# Altium schematic sheet Sheet_2_Power.SchDoc: FBT AVR
size 594 x 420 mm; PageSetup: Record=PageOptions|CenterHorizontal=True|CenterVertical=True|PrintScale=1.00|XCorrection=1.00|YCorrection=1.00|PrintKind=1|BorderSize=5000000|LeftOffset=0|BottomOffset=0|Orientation=2|PaperLength=1000|PaperWidth=1000|Scale=100|PaperSource=15|PrintQuality=1200|MediaType=1|DitherType=10|PaperKind=A3|PrintScaleMode=1; Weight: -; ScaleFactor: -; NormInspection: Норм.Контр.; ApprovedBy: Neboron; CheckedBy: Neboron; DrawnBy: Neboron; DocumentNumber: LH.02.05.12.24 ЭЗ; SheetNumber: 1; SheetTotal: 4; Format: A2; Title1str: V1; ImagePath: 1
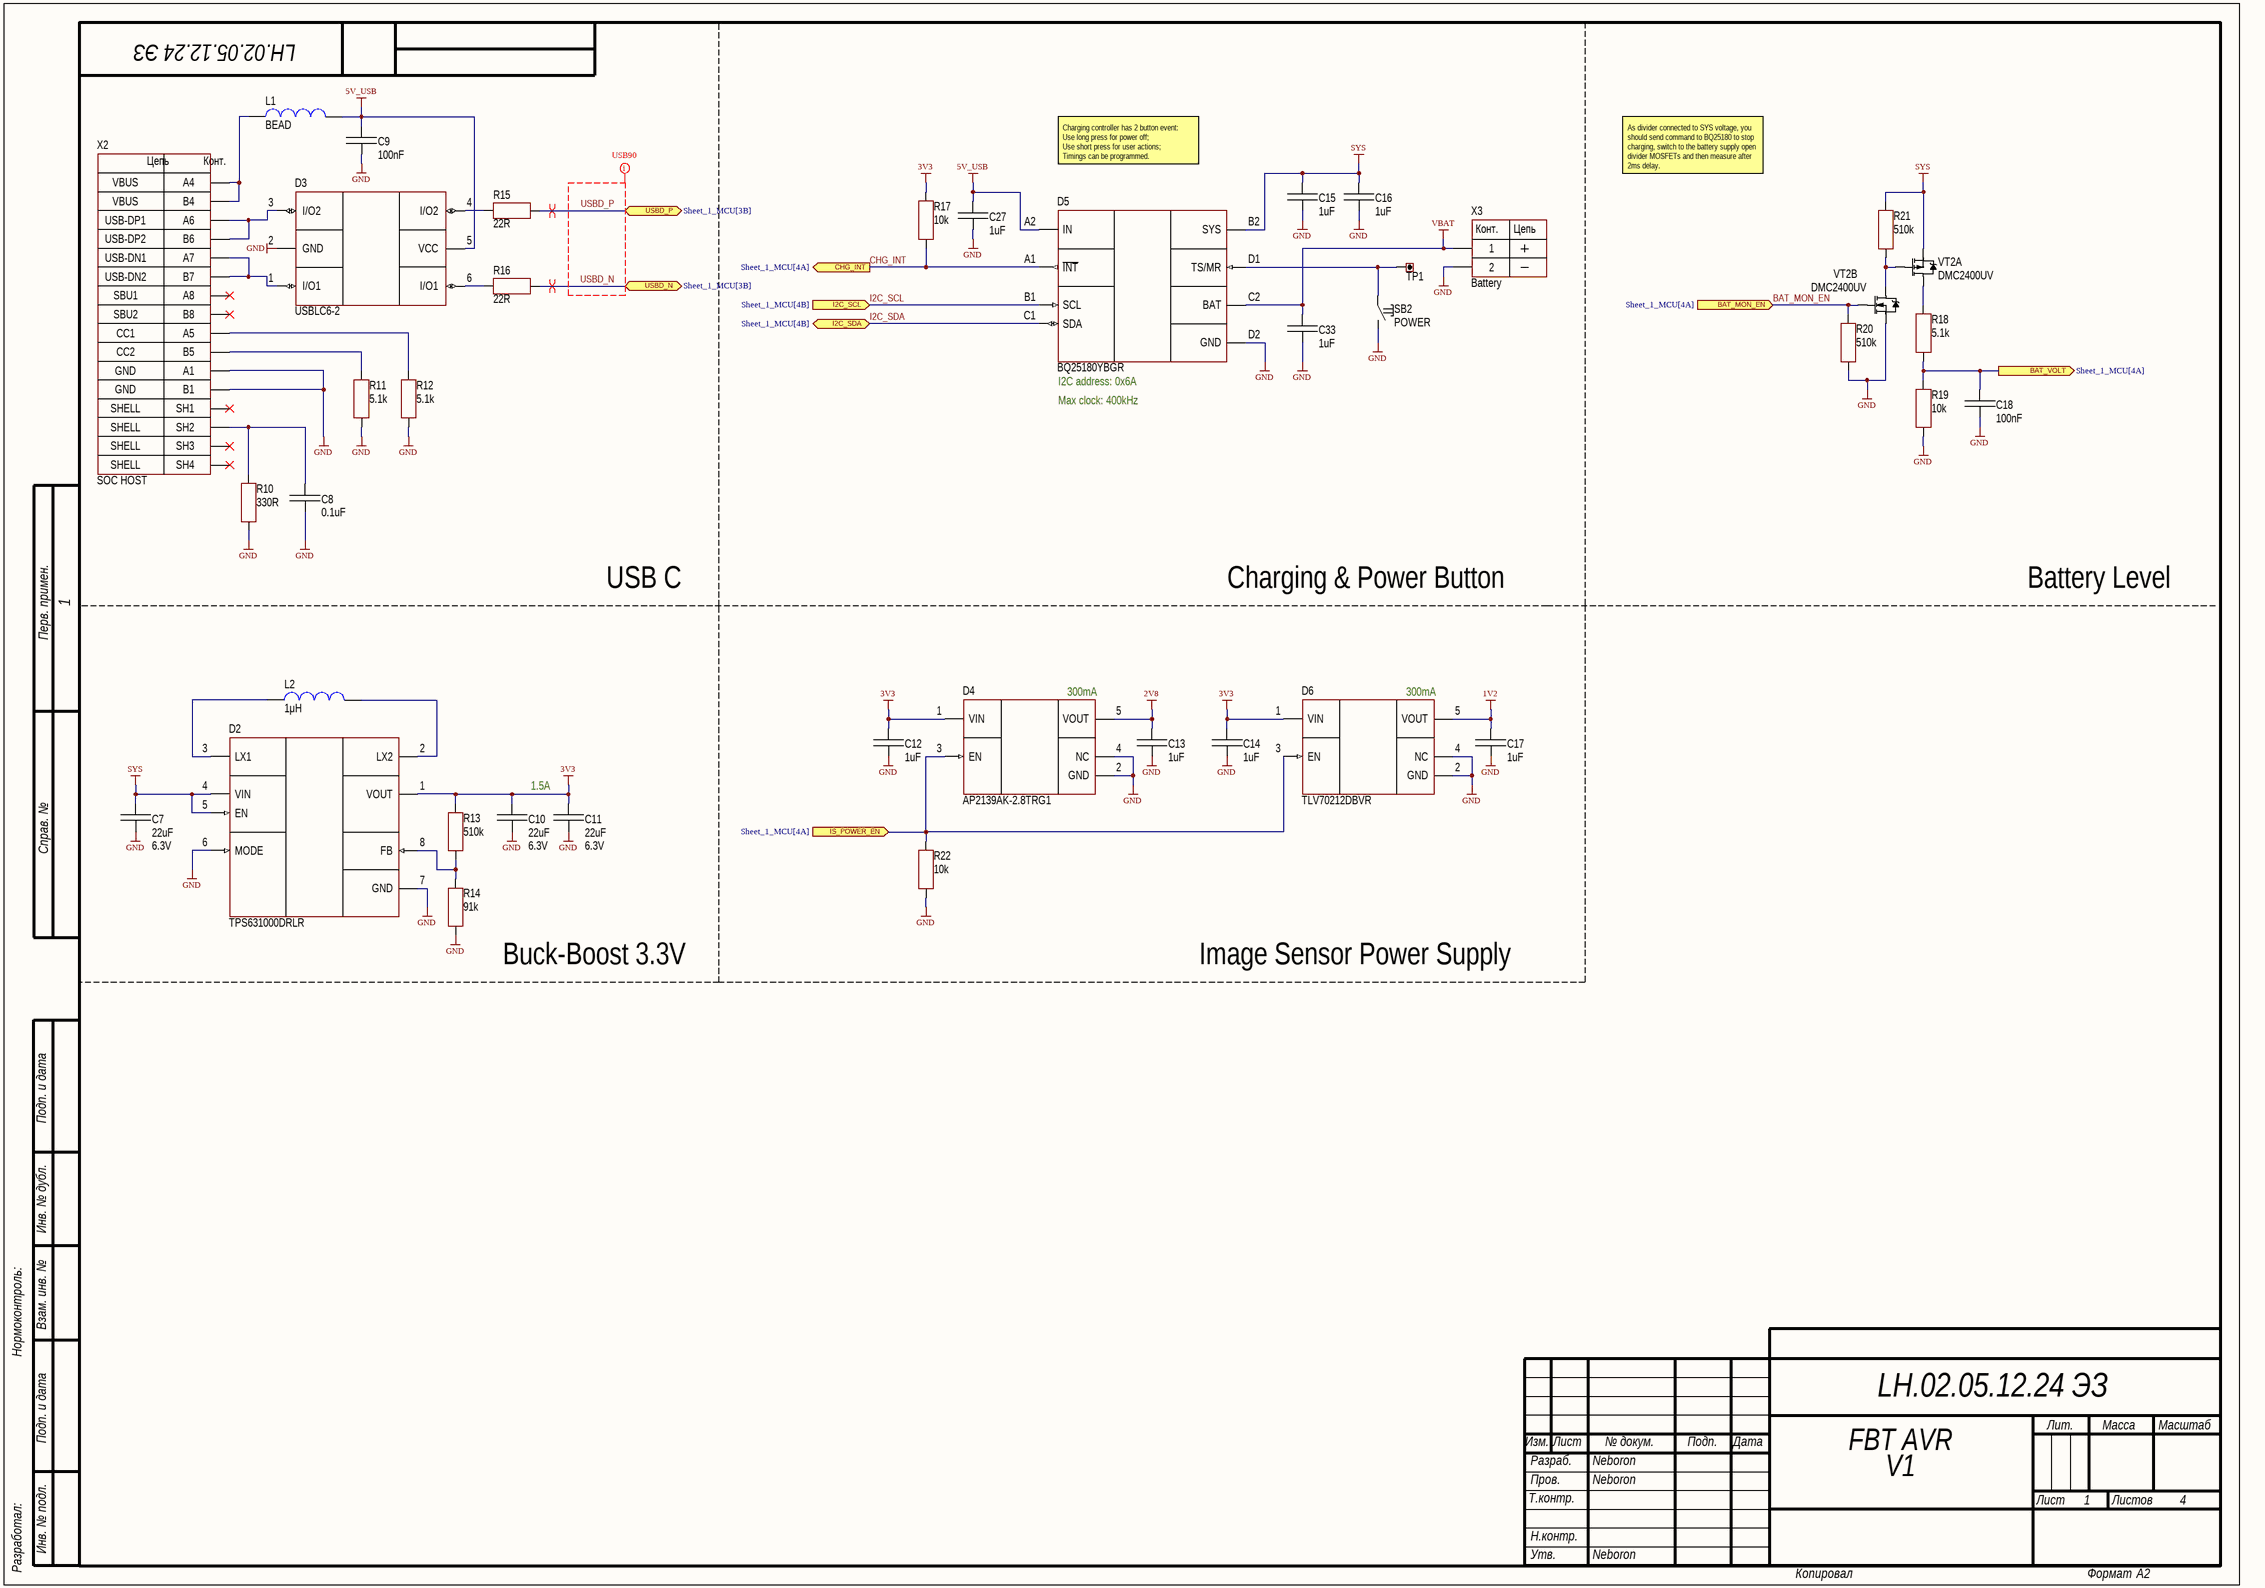
[diagram p0: Sheet_2_Power.SchDoc]

## Parts
C7  value 22uF  Voltage: 6.3V  [CAP: 0603]
C8  value 0.1uF  [CAP: 0603]
C9  value 100nF  [CAP: 0402]
C10  value 22uF  Voltage: 6.3V  [CAP: 0603]
C11  value 22uF  Voltage: 6.3V  [CAP: 0603]
C12  value 1uF  [CAP: 0402]
C13  value 1uF  [CAP: 0402]
C14  value 1uF  [CAP: 0402]
C15  value 1uF  [CAP: 0402]
C16  value 1uF  [CAP: 0402]
C17  value 1uF  [CAP: 0402]
C18  value 100nF  [CAP: 0402]
C27  value 1uF  [CAP: 0402]
C33  value 1uF  [CAP: 0402]
D2  (no value)  [SOT583-8]
D3  (no value)  [SOT23-6]
D4  (no value)  [SOT23-5]
D5  (no value)  [8-DSBGA]
D6  (no value)  [SOT23-5]
L1  value BEAD  [IND: 0402]
L2  value 1μH  [IND: 0805]
R10  value 330R  [RES: 0603]
R11  value 5.1k  [RES: 0402]
R12  value 5.1k  [RES: 0402]
R13  value 510k  [RES: 0402]
R14  value 91k  [RES: 0402]
R15  value 22R  [RES: 0402]
R16  value 22R  [RES: 0402]
R17  value 10k  [RES: 0402]
R18  value 5.1k  [RES: 0402]
R19  value 10k  [RES: 0402]
R20  value 510k  [RES: 0402]
R21  value 510k  [RES: 0402]
R22  value 10k  [RES: 0402]
SB2  CommentText: POWER  [BUT: TS-1186F-B-A]
TP1  (no value)  [CON: TEST POINT 1 MM]
VT2  PartNumber: DMC2400UV  [SOT563-6]  (parts A,B of 2)
X2  CommentText: SOC HOST  [CON: TYPE-C-SOFNG MC-311S]
X3  CommentText: Battery  [CON: BAT (2.00)]

## Ports
BAT_MON_EN (in, see Sheet_1_MCU[4A]), BAT_VOLT (out, see Sheet_1_MCU[4A]), CHG_INT (out, see Sheet_1_MCU[4A]), I2C_SCL (in, see Sheet_1_MCU[4B]), I2C_SDA (bidir, see Sheet_1_MCU[4B]), IS_POWER_EN (in, see Sheet_1_MCU[4A]), USBD_N (bidir, see Sheet_1_MCU[3B]), USBD_P (bidir, see Sheet_1_MCU[3B])

## Nets
1V2: C17.1 D6.5(VOUT)
2V8: C13.1 D4.5(VOUT)
3V3: C10.2 C11.2 C12.1 C14.1 D2.1(VOUT) D4.1(VIN) D6.1(VIN) R13.2 R17.1
5V_USB: C9.1 C27.1 D3.5(VCC) D5.A2(IN) L1.1
GND: C7.1 C8.2 C9.2 C10.1 C11.1 C12.2 C13.2 C14.2 C15.2 C16.2 C17.2 C18.1 C27.2 C33.2 D2.6(MODE) D2.7(GND) D3.2(GND) D4.2(GND) D4.4(NC) D5.D2(GND) D6.2(GND) D6.4(NC) R10.1 R11.1 R12.1 R14.1 R19.1 R20.1 R22.2 SB2.2 VT2.1 X2.A1 X2.B1 X3.2
SYS: C7.2 C15.1 C16.1 D2.4(VIN) D2.5(EN) D5.B2(SYS) R21.2 VT2.4
VBAT: C33.1 D5.C2(BAT) X3.1
BAT_MON_EN: R20.2 VT2.2 ; port BAT_MON_EN
BAT_VOLT: C18.2 R18.1 R19.2 ; port BAT_VOLT
CHG_INT: D5.A1(~{INT}) R17.2 ; port CHG_INT
I2C_SCL: D5.B1(SCL) ; port I2C_SCL
I2C_SDA: D5.C1(SDA) ; port I2C_SDA
IS_POWER_EN: D4.3(EN) D6.3(EN) R22.1 ; port IS_POWER_EN
USBD_N: R16.1 ; port USBD_N
USBD_P: R15.1 ; port USBD_P
NetC8_1: C8.1 R10.2 X2.SH2
NetD2_2: D2.2(LX2) L2.1
NetD2_3: D2.3(LX1) L2.2
NetD2_8: D2.8(FB) R13.1 R14.2
NetD3_1: D3.1(I/O1) X2.A7 X2.B7
NetD3_3: D3.3(I/O2) X2.A6 X2.B6
NetD3_4: D3.4(I/O2) R15.2
NetD3_6: D3.6(I/O1) R16.2
NetD5_D1: D5.D1(TS/MR) SB2.1 TP1.1
NetL1_2: L1.2 X2.A4 X2.B4
NetR11_2: R11.2 X2.B5
NetR12_2: R12.2 X2.A5
NetR18_2: R18.2 VT2.3
NetR21_1: R21.1 VT2.5 VT2.6

Not connected (* = marked no-connect by the designer): X2 A8* B8* SH1* SH3* SH4*

## Layout directives
differential pair: USBD_N, USBD_P
mark named USB90: USBD_N, USBD_P

## Notes on the sheet
- Charging controller has 2 button event:
  Use long press for power off;
  Use short press for user actions;
  Timings can be programmed.
- As divider connected to SYS voltage, you should send command to BQ25180 to stop charging, switch to the battery supply open divider MOSFETs and then measure after 2ms delay.
- (near D5) I2C address: 0x6A
- Max clock: 400kHz
- USB C
- Charging & Power Button
- Battery Level
- (near D4) 300mA
- (near D6) 300mA
- 1.5A
- Buck-Boost 3.3V
- Image Sensor Power Supply
- Перв. примен.
- Справ. №
- Подп. и дата
- Инв. № дубл.
- Нормоконтроль:
- Взам. инв. №
- Изм.
- Лист
- № докум.
- Подп.
- Дата
- Лит.
- Масса
- Масштаб
- Т.контр.
- Пров.
- Разраб.
- Листов
- Разработал:
- Инв. № подл.
- Н.контр.
- Утв.
- Копировал
- Формат
- (in symbol Connector_BAT-2) Конт.; Цепь
- (in symbol Connector_USB_Type_C) Цепь; Конт.; VBUS; USB-DP1; USB-DP2; USB-DN1; USB-DN2; SBU1; SBU2; CC1; CC2; GND; SHELL

## Library data of the parts
C7 C10 C11 = Ceramic_0603: Manufacturer: Any; ValueManufacturerPartNumber: Ceramic capacitor, 22uF, X5R, ±10%, 6.3V, 0603, -55...+125°C; TypeCapacitor: Ceramic capacitor; Tolerance: ±10%; TypeDielectric: X5R; Package: 0603; Temperature: -55...+125°C
C8 = Ceramic_0603: Manufacturer: Any; ValueManufacturerPartNumber: Ceramic capacitor, 0.1uF, X7R, ±10%, 16V, 0603, -55...+125°C; TypeCapacitor: Ceramic capacitor; Tolerance: ±10%; TypeDielectric: X7R; Voltage: 16V; Package: 0603; Temperature: -55...+125°C
C9 C18 = Ceramic_0402: Manufacturer: Any; ValueManufacturerPartNumber: Ceramic capacitor, 100nF, X7R, ±10%, 16V, 0402, -55...+125°C; TypeCapacitor: Ceramic capacitor; Tolerance: ±10%; TypeDielectric: X7R; Voltage: 16V; Package: 0402; Temperature: -55...+125°C
C12-C17 C27 C33 = Ceramic_0402: Manufacturer: Any; ValueManufacturerPartNumber: Ceramic capacitor, 1uF, X7R, ±10%, 16V, 0402, -55...+125°C; TypeCapacitor: Ceramic capacitor; Tolerance: ±10%; TypeDielectric: X7R; Voltage: 16V; Package: 0402; Temperature: -55...+125°C
D2 = TPS631000DRLR: Buck-boost converter; Manufacturer: Texas Instruments; ValueManufacturerPartNumber: DC/DC buck-boost converter, 1.6...5.5V, 2.4MHz, 1.2...5.3V, 1.5A, -40...+125°C, SOT-583; VoltageInput: 1.6...5.5V; Frequency: 2.4MHz; CurrentOutput: 1.5A; VoltageOutput: 1.2...5.3V; HelpURL: https://www.ti.com/lit/ds/symlink/tps631000.pdf?ts=1735302154310&ref_url=https%253A%252F%252Fwww.ti.com%252Fproduct%252FTPS631000; Package: SOT-583; ComponentType: DC/DC buck-boost converter; Temperature: -40...+125°C; PartNumber: TPS631000DRLR
D3 = USBLC6-2: ESD protection; Manufacturer: STMicroelectronics; Isolation: 8kV; HelpURL: https://www.st.com/resource/en/datasheet/usblc6-2.pdf; Package: SOT23-6L; ComponentType: ESD protection; ValueManufacturerPartNumber: =ComponentType+', '+DataRate+', '+Isolation+', '+Supply+', '+Temperature+', '+Package; Temperature: -40...+125°C; PartNumber: USBLC6-2
D4 = AP2139AK-2.8TRG1: Linear voltage regulator 2.8V; Manufacturer: Diodes Incorporated; ValueManufacturerPartNumber: Linear voltage regulator, 2.9...6V, 0.5V, 1.5V, 0.25A, -40...+85°C, SOT23-5; VoltageInput: 2.9...6V; MaxDropout: 0.5V; CurrentOutput: 0.25A; VoltageOutput: 1.5V; HelpURL: https://www.lcsc.com/datasheet/lcsc_datasheet_2304140030_Diodes-Incorporated-AP2139AK-1-5TRG1_C460336.pdf; Package: SOT23-5; ComponentType: Linear voltage regulator; Temperature: -40...+85°C; PartNumber: AP2139AK-2.8TRG1
D5 = BQ25180YBGR: Charger; Manufacturer: Texas Instruments; VoltageInput: input 4.35...26V; CurrentOutput: 1A; HelpURL: https://www.ti.com/lit/ds/symlink/bq25180.pdf?ts=1686486458082&ref_url=https%253A%252F%252Fwww.ti.com%252Fpower-management%252Fbattery-management%252Fcharger-ics%252Fproducts.html; Package: 8-DSBGA; ComponentType: Charger li-ion battery; ValueManufacturerPartNumber: =ComponentType+', '+VoltageInput+', '+VoltageOutput+', '+CurrentOutput+', '+Temperature+', '+Package; Temperature: -40...+125°C; PartNumber: BQ25180YBGR
D6 = TLV70212DBVR: Linear voltage regulator 1.2V; Manufacturer: Texas Instruments; ValueManufacturerPartNumber: Linear voltage regulator, 2...5.5V, 0.26V, 1.2V, 0.3A, -40...+85°C, SOT23-5; VoltageInput: 2...5.5V; MaxDropout: 0.26V; CurrentOutput: 0.3A; HelpURL: https://www.lcsc.com/datasheet/lcsc_datasheet_1810121324_Texas-Instruments-TLV70212DBVR_C81462.pdf; Package: SOT23-5; ComponentType: Linear voltage regulator; Temperature: -40...+85°C; VoltageOutput: 1.2V; PartNumber: TLV70212DBVR
L1 = Inductor_0402: Manufacturer: Murata Electronics; PartNumber: BLM15PX601SN1D; ValueManufacturerPartNumber: Fixed inductor, BEAD, ±25%, 0402, 900mA, -55...+125°C; TypeInductor: Fixed inductor; MaxCurrent: 900mA; Tolerance: ±25%; Package: 0402; HelpURL: https://www.lcsc.com/datasheet/lcsc_datasheet_2304140030_Murata-Electronics-BLM15PX601SN1D_C160977.pdf; Temperature: -55...+125°C
L2 = Inductor_0805: Manufacturer: Taiyo Yuden; PartNumber: MAKK2016T1R0M; ValueManufacturerPartNumber: Fixed inductor, 1μH, ±20%, 0805, 2.2A, -55...+125°C; TypeInductor: Fixed inductor; MaxCurrent: 2.2A; Tolerance: ±20%; Package: 0805; HelpURL: https://www.mouser.ee/datasheet/2/396/wound10_e-1396630.pdf; Temperature: -55...+125°C
R10 = Resistor_0603: Manufacturer: Any; ValueManufacturerPartNumber: Resistor film, 330R, ±5%, 0603, 0.1W, -55...+125°C; TypeResistor: Resistor film; Power: 0.1W; Tolerance: ±5%; Package: 0603; Temperature: -55...+125°C
R11 R12 R18 = Resistor_0402: Manufacturer: Any; ValueManufacturerPartNumber: Resistor film, 5.1k, ±5%, 0402, 0.063W, -55...+125°C; TypeResistor: Resistor film; Power: 0.063W; Tolerance: ±5%; Package: 0402; Temperature: -55...+125°C
R13 R20 R21 = Resistor_0402: Manufacturer: Any; ValueManufacturerPartNumber: Resistor film, 510k, ±5%, 0402, 0.063W, -55...+125°C; TypeResistor: Resistor film; Power: 0.063W; Tolerance: ±5%; Package: 0402; Temperature: -55...+125°C
R14 = Resistor_0402: Manufacturer: Any; ValueManufacturerPartNumber: Resistor film, 91k, ±5%, 0402, 0.063W, -55...+125°C; TypeResistor: Resistor film; Power: 0.063W; Tolerance: ±5%; Package: 0402; Temperature: -55...+125°C
R15 R16 = Resistor_0402: Manufacturer: Any; ValueManufacturerPartNumber: Resistor film, 22R, ±5%, 0402, 0.063W, -55...+125°C; TypeResistor: Resistor film; Power: 0.063W; Tolerance: ±5%; Package: 0402; Temperature: -55...+125°C
R17 R19 R22 = Resistor_0402: Manufacturer: Any; ValueManufacturerPartNumber: Resistor film, 10k, ±5%, 0402, 0.063W, -55...+125°C; TypeResistor: Resistor film; Power: 0.063W; Tolerance: ±5%; Package: 0402; Temperature: -55...+125°C
SB2 = Button_tactile: Manufacturer: XKB Connection; ValueManufacturerPartNumber: Tactile button, TS-1186F; PartNumber: TS-1186F-C-A; TypeButton: Tactile button; HelpURL: https://www.lcsc.com/product-detail/Tactile-Switches_XKB-Connection-TS-1186F-C-A_C908471.html; Package: TS-1186F
TP1 = Connector_Test_Point: Manufacturer: Keystone; ValueManufacturerPartNumber: Test point, Keystone, 5001; PartNumber: 5001; TypeConnector: Test point; HelpURL: https://www.digikey.com/product-detail/en/keystone-electronics/5001/36-5001-ND/255327
VT2 = MOSFET_DUAL_NP_ISO: Manufacturer: Diodes Incorporated; ValueManufacturerPartNumber: MOSFET Dula-channel transistor, 20V, 700mA, N-70pC, P-850pC, 1W, N-480mOhm, P-970mOhm, N-750pF, P-1000pF, SOT563, -55...+150°C; TypeTransistor: MOSFET Dula-channel transistor; VoltageDS: 20V; CurrentDS: 700mA; RDS: N-480mOhm, P-970mOhm; GateCharge: N-70pC, P-850pC; InputCapacitor: N-750pF, P-1000pF; MaxPower: 1W; Package: SOT563; HelpURL: https://www.mouser.ee/datasheet/2/115/DIOD_S_A0010038249_1-2543538.pdf; Temperature: -55...+150°C
X2 = Connector_USB_Type_C: Manufacturer: GCT; ValueManufacturerPartNumber: USB Type C, 5A; PartNumber: TYPEC-304YSSW-ACP16; TypeConnector: USB Type C; CurrentMax: 5A; HelpURL: https://www.mouser.ee/datasheet/2/837/GCT_USB4110_Product_Drawing___20k_cycles-3455479.pdf
X3 = Connector_BAT-2: Pitch: 2mm; Multichannel: 2pin; HelpURL: https://www.chipdip.ru/product/cwf-2r-ds1069-2-mr; ValueManufacturerPartNumber: =TypeConnector+', '+Multichannel+', '+Pitch+', '+VoltageMax+', '+CurrentMax; TypeConnector: Connector